# Altium schematic sheet BREAKER.SchDoc
size C; SheetNumber: 2; SheetTotal: 4
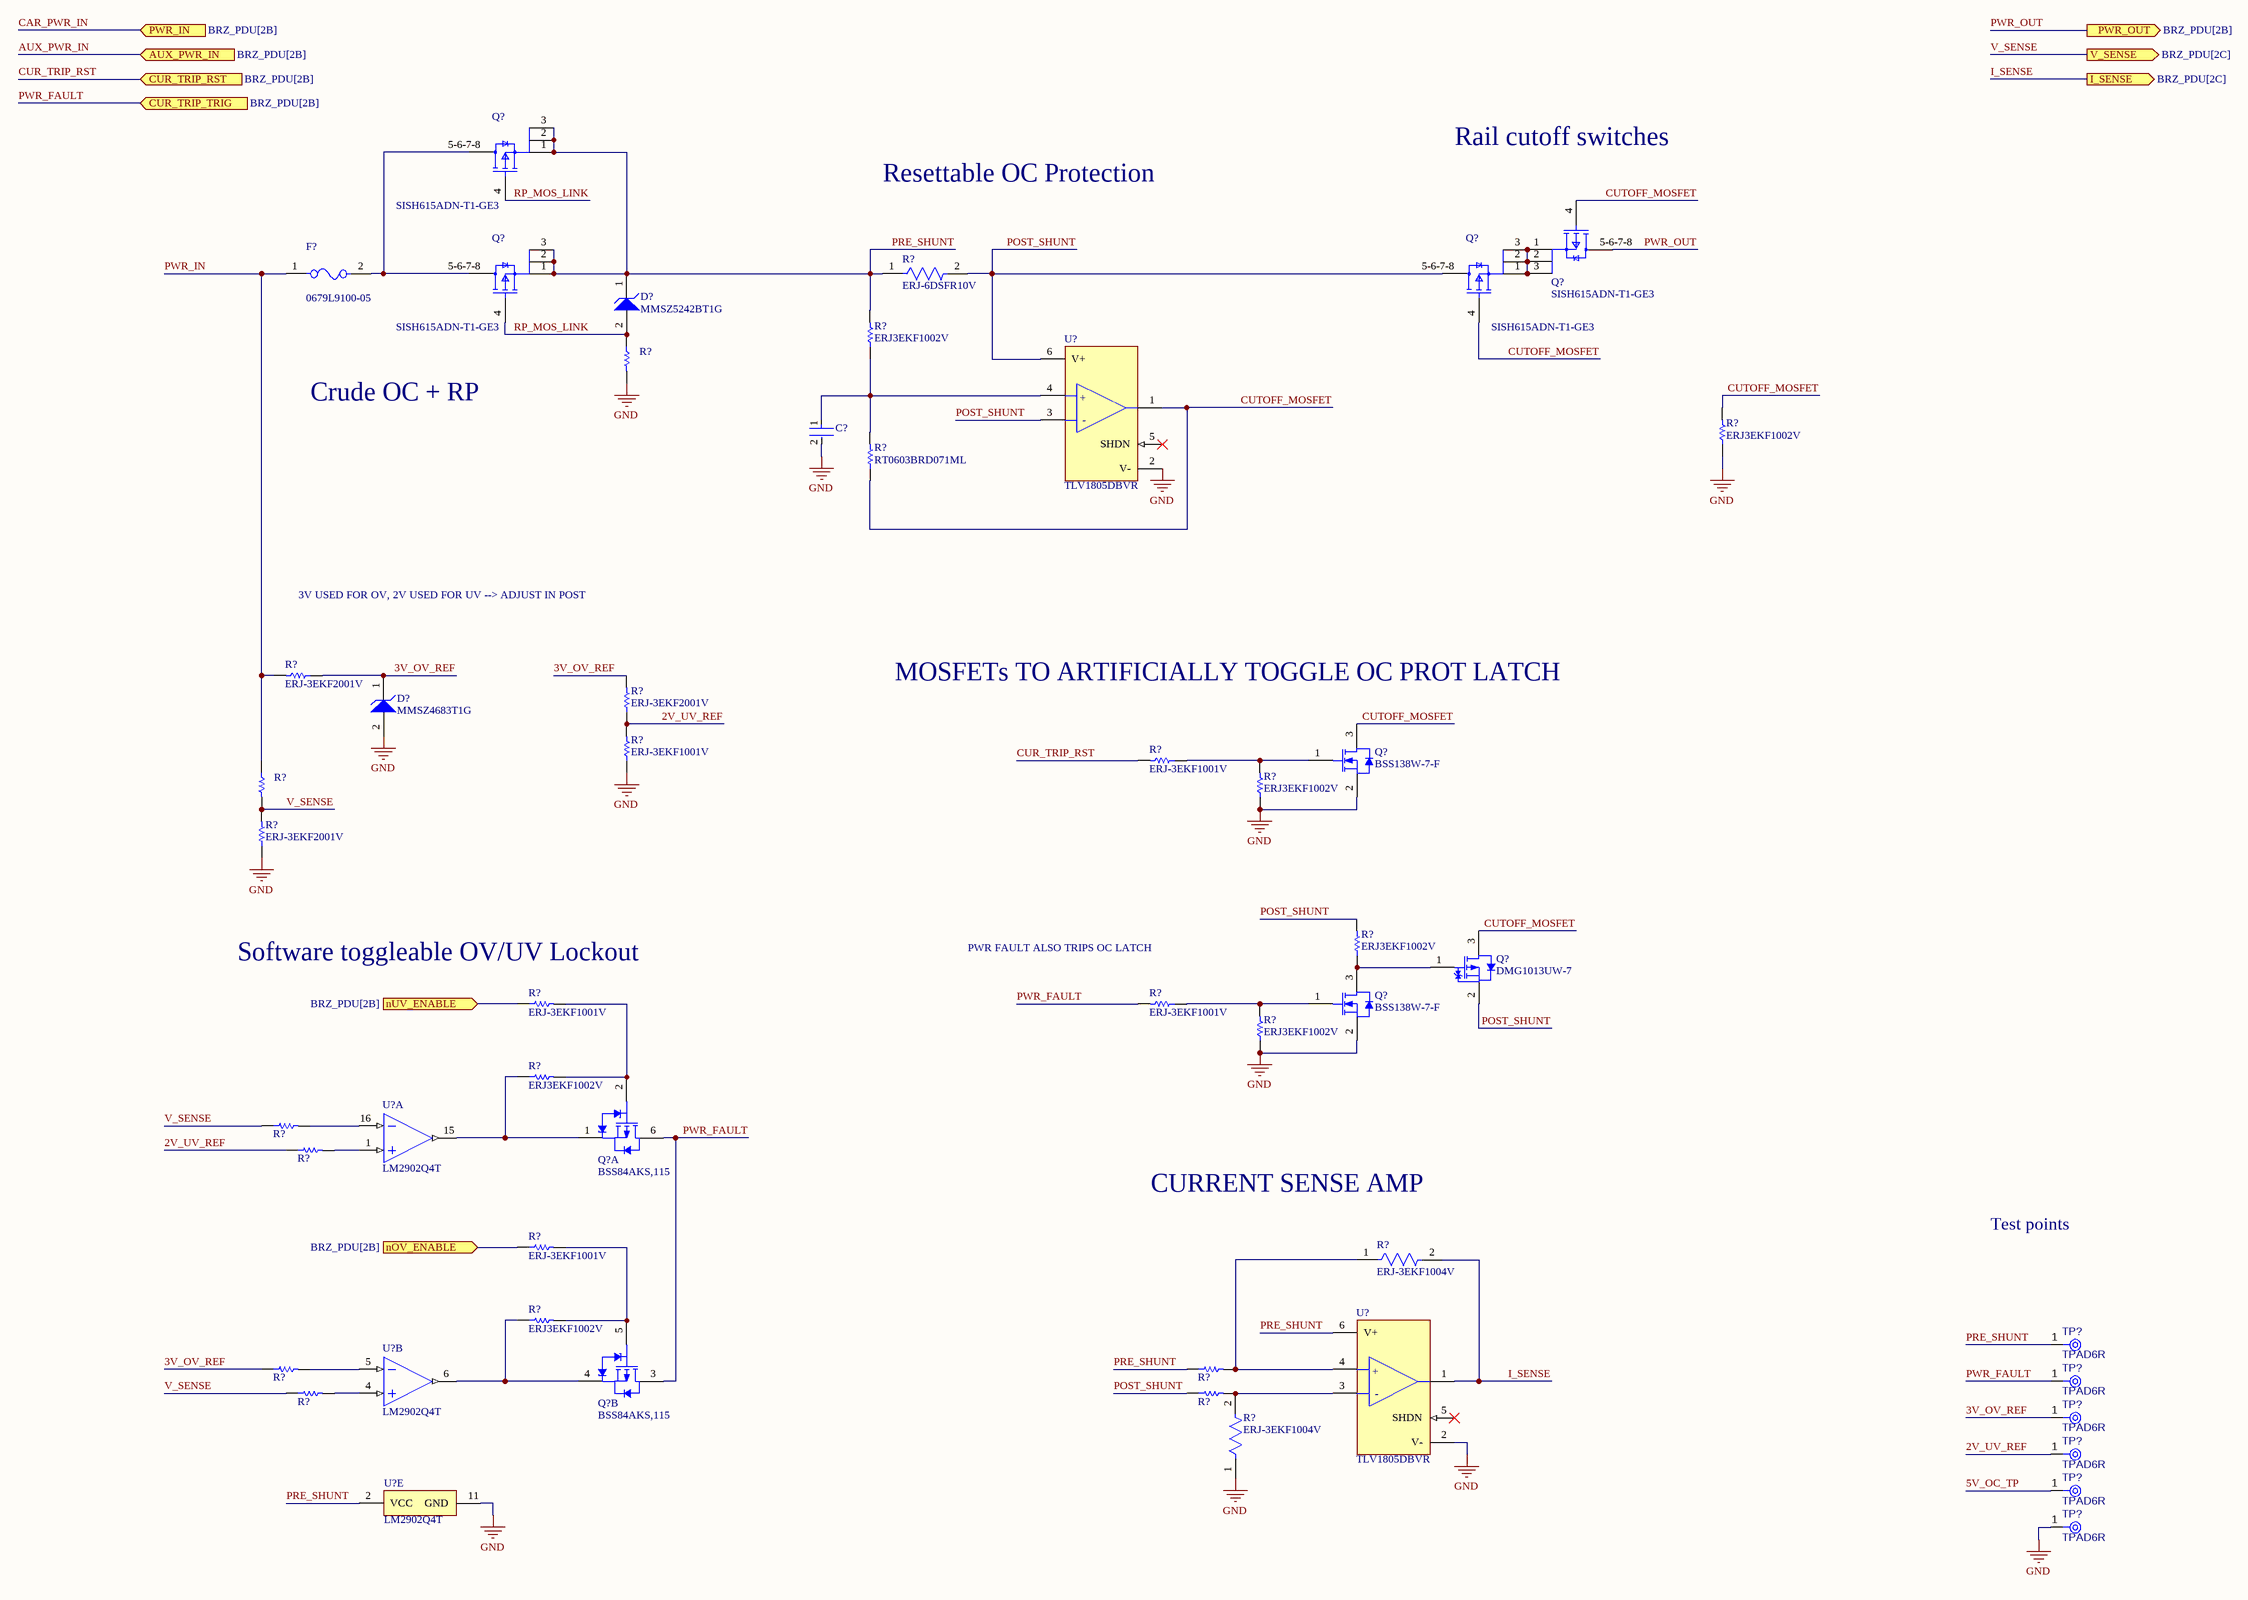
[diagram p0: BREAKER.SchDoc]

## Parts
(Parts that share a designator on the sheet are numbered #1, #2 ... from top to bottom, then left to right.)
C?  GRM188R71H104KA93D  [FP-0402-L_1_0_0_05-W_0_5-IPC_A]  (value not drawn)
D?#1  MMSZ5242BT1G  [ONSC-SOD-123-2-425-04_V]
D?#2  MMSZ4683T1G  [ONSC-SOD-123-2-425-04_V]
F?  0679L9100-05  [FP-0679L-MFG]
Q?#1  SISH615ADN-T1-GE3  [SISH615ADN-T1-GE3-Footprint-1]
Q?#2  SISH615ADN-T1-GE3  [SISH615ADN-T1-GE3-Footprint-1]
Q?#3  SISH615ADN-T1-GE3  [SISH615ADN-T1-GE3-Footprint-1]
Q?#4  SISH615ADN-T1-GE3  [SISH615ADN-T1-GE3-Footprint-1]
Q?#5  BSS138W-7-F  [DIOD-SOT323-3_V]
Q?#6  DMG1013UW-7  [DIOD-SOT323-3_V]
Q?#7  BSS138W-7-F  [DIOD-SOT323-3_V]
Q?#8  BSS84AKS,115  [NXP-SOT363_L]  (part A of 2)
Q?#9  BSS84AKS,115  [NXP-SOT363_L]  (part B of 2)
R?#1  ERJ-6DSFR10V  [FP-ERJ6D-MFG]
R?#2  ERJ3EKF1002V  [RESC1609X55X30LL15T15]  (value not drawn)
R?#3  ERJ3EKF1002V  [RESC1609X55X30LL15T15]
R?#4  ERJ3EKF1002V  [RESC1609X55X30LL15T15]
R?#5  RT0603BRD071ML  [RESC1608X55X30NL20T20]
R?#6  ERJ-3EKF2001V  [RESC1608X55X30ML15T15]
R?#7  ERJ-3EKF2001V  [RESC1608X55X30ML15T15]
R?#8  ERJ-3EKF1001V  [RESC1608X55X30LL15T15]
R?#9  ERJ3EKF1002V  [RESC1609X55X30LL15T15]  (value not drawn)
R?#10  ERJ-3EKF1001V  [RESC1608X55X30LL15T15]
R?#11  ERJ3EKF1002V  [RESC1609X55X30LL15T15]
R?#12  ERJ-3EKF2001V  [RESC1608X55X30ML15T15]
R?#13  ERJ3EKF1002V  [RESC1609X55X30LL15T15]
R?#14  ERJ-3EKF1001V  [RESC1608X55X30LL15T15]
R?#15  ERJ-3EKF1001V  [RESC1608X55X30LL15T15]
R?#16  ERJ3EKF1002V  [RESC1609X55X30LL15T15]
R?#17  ERJ3EKF1002V  [RESC1609X55X30LL15T15]
R?#18  ERJ3EKF1002V  [RESC1609X55X30LL15T15]  (value not drawn)
R?#19  ERJ3EKF1002V  [RESC1609X55X30LL15T15]  (value not drawn)
R?#20  ERJ-3EKF1001V  [RESC1608X55X30LL15T15]
R?#21  ERJ-3EKF1004V  [FP-ERJ3EK-IPC_C]
R?#22  ERJ3EKF1002V  [RESC1609X55X30LL15T15]
R?#23  ERJ3EKF1002V  [RESC1609X55X30LL15T15]  (value not drawn)
R?#24  ERJ3EKF1002V  [RESC1609X55X30LL15T15]  (value not drawn)
R?#25  ERJ3EKF1002V  [RESC1609X55X30LL15T15]  (value not drawn)
R?#26  ERJ3EKF1002V  [RESC1609X55X30LL15T15]  (value not drawn)
R?#27  ERJ-3EKF1004V  [FP-ERJ3EK-IPC_C]
TP?#1  TPAD6R  [TP06R]  (no BOM)
TP?#2  TPAD6R  [TP06R]  (no BOM)
TP?#3  TPAD6R  [TP06R]  (no BOM)
TP?#4  TPAD6R  [TP06R]  (no BOM)
TP?#5  TPAD6R  [TP06R]  (no BOM)
TP?#6  TPAD6R  [TP06R]  (no BOM)
U?#1  TLV1805DBVR  [FP-DBV0006A-IPC_C]
U?#2  LM2902Q4T  [LM2902Q4T-Footprint-1]  (part A of 5)
U?#3  TLV1805DBVR  [FP-DBV0006A-IPC_C]
U?#4  LM2902Q4T  [LM2902Q4T-Footprint-1]  (part B of 5)
U?#5  LM2902Q4T  [LM2902Q4T-Footprint-1]  (part E of 5)

## Ports
AUX_PWR_IN (in, see BRZ_PDU[2B]), CUR_TRIP_RST (in, see BRZ_PDU[2B]), CUR_TRIP_TRIG (in, see BRZ_PDU[2B]), I_SENSE (out, see BRZ_PDU[2C]), nOV_ENABLE (in, see BRZ_PDU[2B]), nUV_ENABLE (in, see BRZ_PDU[2B]), PWR_IN (in, see BRZ_PDU[2B]), PWR_OUT (out, see BRZ_PDU[2B]), V_SENSE (out, see BRZ_PDU[2C])

## Nets
GND: C?.2 D?#2.2(A) Q?#5.2(S) Q?#7.2(S) R?#2.2 R?#4.1 R?#8.1 R?#11.1 R?#12.1 R?#16.1 R?#27.1 TP?#6.1(TP) U?#1.2(V-) U?#3.2(V-) U?#5.11(GND)
2V_UV_REF: R?#7.1 R?#8.2 R?#19.1 TP?#4.1(TP)
3V_OV_REF: D?#2.1(K) R?#6.1 R?#7.2 R?#23.1 TP?#3.1(TP)
5V_OC_TP: TP?#5.1(TP)
AUX_PWR_IN: port AUX_PWR_IN
CAR_PWR_IN: port PWR_IN
CUR_TRIP_RST: R?#10.2 ; port CUR_TRIP_RST
CUTOFF_MOSFET: Q?#2.4(G) Q?#4.4(G) Q?#5.3(D) Q?#6.3(D) R?#4.2 R?#5.1 U?#1.1(OUT)
I_SENSE: R?#21.2 U?#3.1(OUT) ; port I_SENSE
nOV_ENABLE: R?#20.1 ; port nOV_ENABLE
nUV_ENABLE: R?#14.1 ; port nUV_ENABLE
POST_SHUNT: Q?#4.5-6-7-8(D) Q?#6.2(S) R?#1.2 R?#13.2 R?#26.1 U?#1.3(-IN) U?#1.6(V+)
PRE_SHUNT: D?#1.1(K) Q?#1.1(S) Q?#1.2(S) Q?#1.3(S) Q?#3.1(S) Q?#3.2(S) Q?#3.3(S) R?#1.1 R?#3.2 R?#24.1 TP?#1.1(TP) U?#3.6(V+) U?#5.2(VCC)
PWR_FAULT: Q?#8.6(D1) Q?#9.3(D2) R?#15.2 TP?#2.1(TP) ; port CUR_TRIP_TRIG
PWR_IN: F?.1 R?#6.2 R?#9.1
PWR_OUT: Q?#2.5-6-7-8(D) ; port PWR_OUT
RP_MOS_LINK: D?#1.2(A) Q?#1.4(G) Q?#3.4(G) R?#2.1
V_SENSE: R?#9.2 R?#12.2 R?#18.1 R?#25.1 ; port V_SENSE
NetC?_1: C?.1 R?#3.1 R?#5.2 U?#1.4(+IN)
NetF?_2: F?.2 Q?#1.5-6-7-8(D) Q?#3.5-6-7-8(D)
NetQ?#2_1: Q?#2.1(S) Q?#2.2(S) Q?#2.3(S) Q?#4.1(S) Q?#4.2(S) Q?#4.3(S)
NetQ?#5_1: Q?#5.1(G) R?#10.1 R?#11.2
NetQ?#6_1: Q?#6.1(G) Q?#7.3(D) R?#13.1
NetQ?#7_1: Q?#7.1(G) R?#15.1 R?#16.2
NetQ?#8_1: Q?#8.1(S1) R?#17.1 U?#2.15(1OUT)
NetQ?#8_2: Q?#8.2(G1) R?#14.2 R?#17.2
NetQ?#9_4: Q?#9.4(S2) R?#22.1 U?#4.6(2OUT)
NetQ?#9_5: Q?#9.5(G2) R?#20.2 R?#22.2
NetR?#18_2: R?#18.2 U?#2.16(1IN-)
NetR?#19_2: R?#19.2 U?#2.1(1IN+)
NetR?#21_1: R?#21.1 R?#24.2 U?#3.4(+IN)
NetR?#23_2: R?#23.2 U?#4.5(2IN-)
NetR?#25_2: R?#25.2 U?#4.4(2IN+)
NetR?#26_2: R?#26.2 R?#27.2 U?#3.3(-IN)

Not connected (* = marked no-connect by the designer): U?#1 5(SHDN)*; U?#3 5(SHDN)*

## Notes on the sheet
- Rail cutoff switches
- Resettable OC Protection
- Crude OC + RP
- 3V USED FOR OV, 2V USED FOR UV --> ADJUST IN POST
- MOSFETs TO ARTIFICIALLY TOGGLE OC PROT LATCH
- (near R?#14) Software toggleable OV/UV Lockout
- PWR FAULT ALSO TRIPS OC LATCH
- CURRENT SENSE AMP
- Test points
- (in symbol CMP-04896-000098-1) +; -

## Library data of the parts
C? = CMP-001-00058-1: LARGE PADS, 0402 CAP, CHANGE COMMENT TO MATCH REAL P/N; Capacitor Type: Ceramic; Min Operating Temperature: -55°C; Mounting Technology: Surface Mount; Pins: 2; Case/Package: 0402; RoHS Compliant: Yes; Max Operating Temperature: 85°C
D?#1 = CMP-1060-00565-1: Zener Voltage Regulator, 500 mW, 2-Pin SOD-123, Pb-Free, Tape and Reel; Manufacturer: On Semiconductor; P Max (W): 0.5; VZ Typ (V): 12; PartNumber: MMSZ5242BT1G; PackageReference: SOD-123-2-425-04; ComponentLink3URL: http://www.onsemi.com/pub_link/Collateral/425-04.PDF; Mounting Technology: Surface Mount; ComponentLink2Description: Datasheet; ComponentLink1URL: http://www.onsemi.com/; ComponentLink3Description: Package Specification; PackageDescription: 2-Pin SOD, Body 1.6 x 2.69 mm; PackageVersion: Rev. G, 10/2009; ComponentLink1Description: Manufacturer URL; RoHS: Pb-Free; ComponentLink2URL: http://www.onsemi.com/pub_link/Collateral/MMSZ5221BT1-D.PDF; Packing: Tape and Reel; DatasheetVersion: Rev. 12
D?#2 = CMP-1060-00600-1: Zener Voltage Regulator, 500 mW, 2-Pin SOD-123, Pb-Free, Tape and Reel; Manufacturer: On Semiconductor; P Max (W): 0.5; VZ Typ (V): 3; ComponentLink2Description: Datasheet; ComponentLink3URL: http://www.onsemi.com/pub_link/Collateral/425-04.PDF; PackageVersion: Rev. G, 10/2009; RoHS: Pb-Free; ComponentLink2URL: http://www.onsemi.com/pub_link/Collateral/MMSZ4678T1-D.PDF; DatasheetVersion: Rev. 9; PackageDescription: 2-Pin SOD, Body 1.6 x 2.69 mm; PartNumber: MMSZ4683T1G; ComponentLink3Description: Package Specification; ComponentLink1URL: http://www.onsemi.com/; ComponentLink1Description: Manufacturer URL; Packing: Tape and Reel; PackageReference: SOD-123-2-425-04; Mounting Technology: Surface Mount
F? = CMP-16042-000002-1: DIFF P#!!! / FUSE BRD MNT 10A 125VAC/VDC; Manufacturer: Bel Fuse; Manufacturer Part Number: 0679L9150-01; Max Fuse Ac Voltage: 125V; Fuse Blow Speed: Fast; Fuse Current: 15A; Fuse I2T: 103.5A2Sec; Fuse Interrupt Ac Current: 50A; Automotive Grade: Grade 1; Value: 0.0038Ω; Fuse Interrupt Dc Current: 300A; Fuse Voltage Drop: 0.13V; Device Class L2: Fuses; ComponentLink2URL: https://www.belfuse.com/resources/CircuitProtection/datasheets/0679L%20Sep2016.pdf; Package: 0679L; Height: 2.79mm; Digikey Description: FUSE BRD MNT 15A 125VAC/VDC; Temperature Range High: +125°C; Device Class L3: unset; Octopart: https://octopart.com/0679l9150-01-bel+fuse-70850665; Temperature Range Low: -55°C; Max Fuse Dc Voltage: 125V; Ipc Land Pattern Name: CAPC610254X254; Category: Fuse; Lead Free: Yes; Automotive: Yes; Resistance: 0.0038Ω; RoHS: TRUE; Device Class L1: Circuit Protection; ComponentLink2Description: Datasheet; Temperature: -55°C to +125°C; Voltage Rating: 125V
Q?#1 Q?#3 = CMP-013-00036-2: Trans MOSFET P-CH 20V 22.1A 8-Pin PowerPAK 1212 EP T/R
Q?#2 Q?#4 = CMP-013-00036-1: Trans MOSFET P-CH 20V 22.1A 8-Pin PowerPAK 1212 EP T/R
Q?#5 Q?#7 = CMP-2000-05968-1: N-Channel Enhancement Mode Mosfet, 50 V, 200 mA, -55 to 150 degC, 6-Pin SOT-323, RoHS, Tape and Reel; Typical Turn-Off Delay Time: 20ns; Number of Channels: 1Channel; Type: EnhancementModeFieldEffectTransistor; Brand: DiodesIncorporated; Vds - Drain-Source Breakdown Voltage: 75V; Vgs - Gate-Source Voltage: 20V; Rds On - Drain-Source Resistance: 1.4Ohms; Transistor Type: 1N-Channel; Configuration: Single; Unit Weight: 0.000212oz; Pd - Power Dissipation: 200mW; Id - Continuous Drain Current: 200mA; Forward Transconductance - Min: 0.1S; Manufacturer URL: http://www.diodes.com/; Series: BSS138; Package Description: 3-Pin Small Outline Transistor, Body 2 x 1.25 mm, Pitch 0.65 mm; Mounting Technology: SurfaceMount; Product Category: MOSFET; RoHS: True; Maximum Operating Temperature: +150C; Height: 1mm; Length: 2.2mm; Technology: Si; Width: 1.35mm; Datasheet URL: http://www.diodes.com/_files/datasheets/ds30206.pdf; Manufacturer: DiodesIncorporated; Package / Case: SOT-323-3; Typical Turn-On Delay Time: 20ns; Transistor Polarity: N-Channel; Factory Pack Quantity: 3000; Packaging: Reel; Product: MOSFETSmallSignal; Datasheet Version: Rev. 11-2, 09/2013; Package Reference: SOT323; Minimum Operating Temperature: -55C; Mounting Style: SMD/SMT; Channel Mode: Enhancement
Q?#6 = CMP-2000-06170-1: P-Channel Enhancement Mode MOSFET, 310 mW, 20 V, -55 to 150 degC, 3-Pin SOT-323, RoHS, Tape and Reel; Manufacturer: Diodes Inc; Qg Gate Charge: 0.622nC; Drain-Source On Resistance-Max: 750mO; Rated Power Dissipation: 310mW; Drain-to-Source Voltage [Vdss]: 20V; Package Reference: SOT323; Datasheet Version: Rev. 3-2, 09/2013; Package Description: 3-Pin Small Outline Transistor, Body 2 x 1.25 mm, Pitch 0.65 mm; Mounting Technology: SurfaceMount; Manufacturer URL: http://www.diodes.com/; Datasheet URL: http://www.diodes.com/_files/datasheets/ds31861.pdf; Channel Type: P-Channel
Q?#8 Q?#9 = CMP-1259-00116-1: Dual P-Channel Trench MOSFET, -50 V, -0.16 A, -55 to 150 degC, 6-Pin SOT363, Tape and Reel; Manufacturer: NXP Semiconductors; VGSth [typ] (V): -1.6; Automotive Qualified: Y; Channel Type: P; IDM [max] (A): -0.64; Packing: Tape & Reel; Mounting Technology: Surface Mount; PackageDescription: 6-Pin Small Outline Transistor Package, Body 2 x 1.25 mm, Pitch 0.65 mm; ComponentLink2URL: http://www.nxp.com/documents/data_sheet/BSS84AKS.pdf; ComponentLink3URL: http://www.nxp.com/documents/outline_drawing/sot363_po.pdf; PartNumber: BSS84AKS,115; PackageReference: SOT363; PackageVersion: 06-03-16, 03/2006; ComponentLink3Description: Package Specification; ComponentLink2Description: Datasheet; ComponentLink1Description: Manufacturer URL; VDS [max] (V): -50; Code_JEITA: SC-88; ID [max] (A): -0.16; DatasheetVersion: Rev. 1; ComponentLink1URL: http://www.nxp.com/
R?#1 = CMP-05422-000098-1: RES 0.1 OHM 1% 1/2W 0805; Temperature Coefficient: 150ppm/°C; Resistance: 100mR; Max Power Dissipation: 500mW; Tolerance: 1%; Length: 0.079inch; Features: Automotive AEC-Q200; Width: 0.049inch; Resistor Type: Thick Film; Case Code (Metric): 2012; Number of Terminations: 2; Max Operating Temperature: 155°C; Case/Package: 0805; Height: 0.028inch; Packaging: Cut Tape; Case Code (Imperial): 0805; Min Operating Temperature: -55°C
R?#2-R?#4 R?#9 R?#11 R?#13 R?#16-R?#19 R?#22-R?#26 = CMP-1012-00623-3: Chip Resistor, 10 KOhm, +/- 1%, 0.1 W, -55 to 155 degC, 0603 (1608 Metric), RoHS, Tape and Reel; Manufacturer: Panasonic; Voltage Rating: 75V; Case\/Package: 0603; Power Rating: 100mW; Resistance: 10KOhm; Temperature Coefficient: 100ppm\/degreesC; Number of Pins: 2; Package Reference: 603; Depth: 0.8mm; Mount: SurfaceMount; Package Description: 2-Pin Surface Mount Device, Body 1.6 x 0.85 mm; Datasheet Version: 02/2017; Length: 1.6mm; Lead Free: LeadFree; Height: 0.45mm; Number of Terminations: 2; Max Power Dissipation: 100mW; Min Operating Temperature: -55degC; Datasheet URL: https://industrial.panasonic.com/cdbs/www-data/pdf/RDA0000/AOA0000C304.pdf; Termination: SMD/SMT; Case Code (Metric): 1608; Case Code (Imperial): 0603; Tolerance: 1%; Max Operating Temperature: 155degC; RoHSCompliant: true; Voltage Rating (DC): 75V; Radiation Hardening: No; Packaging: TapeandReel; Composition: ThickFilm; Mounting Technology: SurfaceMount; Manufacturer URL: http://www.panasonic.com/; Width: 0.031inch; REACH SVHC: NoSVHC; Contact Plating: Tin; Military Standard: Not; Package Quantity: 1
R?#5 = CMP-2000-00925-1: NOT PANASONIC, THIS IS A 1M RESISTORhttps://www.yageo.com/upload/media/product/productsearch/datasheet/rchip/PYu-RT_1-to-0.01_RoHS_L_13.pdf; Part Number: ERA-3AEB163V; Manufacturer: Panasonic
R?#6 R?#7 R?#12 = CMP-2000-00317-1: Manufacturer: Panasonic; Part Number: ERJ-3EKF2001V
R?#8 R?#10 R?#14 R?#15 R?#20 = CMP-2000-00180-1: Manufacturer: Panasonic; Part Number: ERJ-3EKF1001V
R?#21 R?#27 = CMP-1012-00849-3: RES SMD 1M OHM 1% 1/10W 0603; Resistance: 1MR; Voltage Rating: 75V; Temperature Coefficient: 100ppm/°C; Power Rating: 100mW; REACH SVHC: No SVHC; Radiation Hardening: No; Features: Automotive AEC-Q200; Case Code (Metric): 1608; Resistance Tolerance: 1%; Case/Package: 0603; Termination: SMD/SMT; Max Operating Temperature: 155°C; Tolerance: 1%; Size Code: 0603; Case Code (Imperial): 0603; Min Operating Temperature: -55°C; Number of Pins: 2; Mount: Surface Mount; Package Quantity: 1; Military Standard: Not; Voltage Rating (DC): 75V; Depth: 0.8mm; Packaging: Tape and Reel; Width: 0.8mm; Number of Terminations: 2; Length: 1.6mm; Height: 0.022inch; RoHS Compliant: Yes; Resistor Type: Thick Film; Contact Plating: Tin; Lead Free: Lead Free; Series: ERJ; Construction: Rectangular; Max Power Dissipation: 100mW
TP?#1-TP?#6 = CMP-00028-00002-2: 0.6mm round; Pins: 1
U?#1 U?#3 = CMP-04896-000098-1: 40V, RAIL-TO-RAIL INPUT, PUSH-PU
U?#2 U?#4 U?#5 = CMP-014-00004-1: LM2902 Series 30 V 1.3 MHz Low-Power Quad Operational Amplifier - QFN-16 (3x3)